# Altium schematic sheet C40 IMB POWER SUPPLY.SchDoc: C40 IMB POWER SUPPLY
size B; Organization: Carnegie Institution of Washington; DocumentNumber: 7; SheetNumber: 6; SheetTotal: 7; PageSetup: Record=PageOptions|CenterHorizontal=True|CenterVertical=True|PrintScale=1.12|XCorrection=1.00|YCorrection=1.00|PrintKind=0|BorderSize=5000000|LeftOffset=0|BottomOffset=0|Orientation=2|PaperLength=1000|PaperWidth=1000|Scale=100|PaperSource=15|PrintQuality=1200|MediaType=1|DitherType=10|PaperKind=11 x 17|PrintScaleMode=1
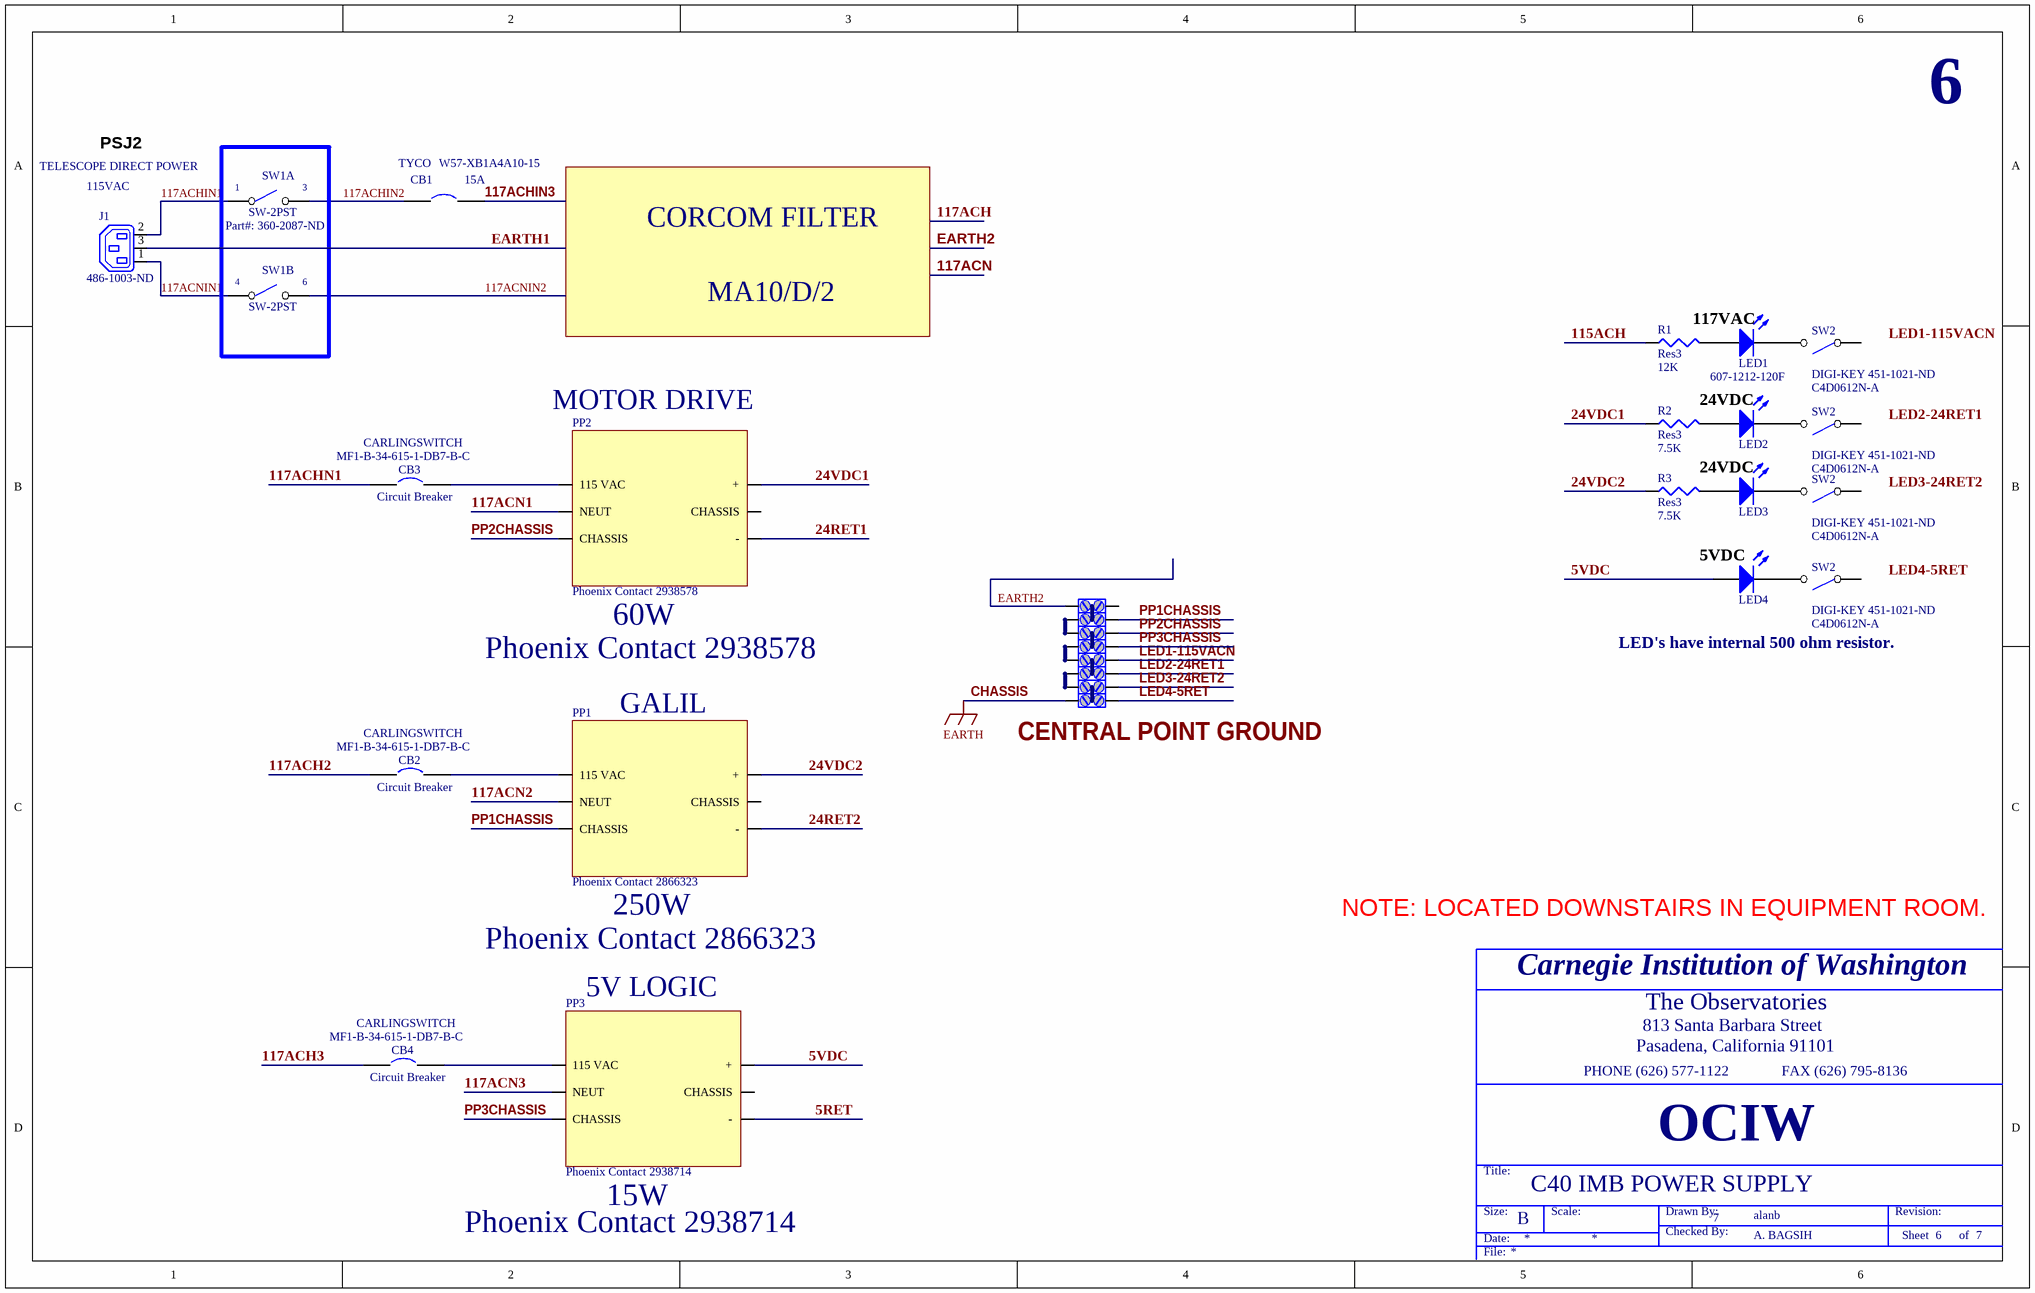
[diagram p0: C40 IMB POWER SUPPLY.SchDoc]

## Parts
(Parts that share a designator on the sheet are numbered #1, #2 ... from top to bottom, then left to right.)
?#1  (no value)
?#2  (no value)
?#3  (no value)
?#4  (no value)
?#5  (no value)
?#6  (no value)
?#7  (no value)
?#8  (no value)
CB1  15A
CB2  Circuit Breaker  Manufacturer: CARLINGSWITCH  PART#: MF1-B-34-615-1-DB7-B-C  [SPST-2]
CB3  Circuit Breaker  Manufacturer: CARLINGSWITCH  PART#: MF1-B-34-615-1-DB7-B-C  [SPST-2]
CB4  Circuit Breaker  Manufacturer: CARLINGSWITCH  PART#: MF1-B-34-615-1-DB7-B-C  [SPST-2]
D?#1  LED1  Manuf #: 607-1212-120F  [LED-0]
D?#2  LED2  [LED-0]
D?#3  LED3  [LED-0]
D?#4  LED4  [LED-0]
J1  115VAC  PART #: 486-1003-ND  [IEC7-2H3]
PP1  Phoenix Contact 2866323
PP2  Phoenix Contact 2938578
PP3  Phoenix Contact 2938714
R1  Res3  value 12K  [J1-0603]
R2  Res3  value 7.5K  [J1-0603]
R3  Res3  value 7.5K  [J1-0603]
SW1A  SW-2PST  Part#: 360-2087-ND
SW1B  SW-2PST
SW2#1  Part #: DIGI-KEY 451-1021-ND  Electroswitch: C4D0612N-A
SW2#2  Part #: DIGI-KEY 451-1021-ND  Electroswitch: C4D0612N-A
SW2#3  Part #: DIGI-KEY 451-1021-ND  Electroswitch: C4D0612N-A
SW2#4  Part #: DIGI-KEY 451-1021-ND  Electroswitch: C4D0612N-A

## Nets
CHASSIS: ?#8.1  [also labelled EARTH]
5RET: PP3.24(-)
5VDC: D?#4.1(A) PP3.25(+)
24RET1: PP2.24(-)
24RET2: PP1.24(-)
24VDC1: PP2.25(+) R2.1
24VDC2: PP1.25(+) R3.1
115ACH: R1.1
117ACH2: CB2.1
117ACH3: CB4.1
117ACHIN1: J1.2(N) SW1A.1
117ACHIN2: CB1.1 SW1A.2
117ACHIN3: CB1.2
117ACHN1: CB3.1
117ACN1: PP2.22(NEUT)
117ACN2: PP1.22(NEUT)
117ACN3: PP3.22(NEUT)
117ACNIN1: J1.1(L) SW1B.1
117ACNIN2: SW1B.2
EARTH1: J1.3(E)
EARTH2: ?#1.1
LED1-115VACN: ?#5.2
LED2-24RET1: ?#6.2
LED3-24RET2: ?#7.2
LED4-5RET: ?#8.2
PP1CHASSIS: ?#2.2 PP1.23(CHASSIS)
PP2CHASSIS: ?#3.2 PP2.23(CHASSIS)
PP3CHASSIS: ?#4.2 PP3.23(CHASSIS)
Net?#2_1: ?#2.1 ?#3.1
Net?#4_1: ?#4.1 ?#5.1
Net?#6_1: ?#6.1 ?#7.1
NetCB2_2: CB2.2 PP1.21(115_VAC)
NetCB3_2: CB3.2 PP2.21(115_VAC)
NetCB4_2: CB4.2 PP3.21(115_VAC)
NetD?#1_1: D?#1.1(A) R1.2
NetD?#1_2: D?#1.2(K) SW2#1.2
NetD?#2_1: D?#2.1(A) R2.2
NetD?#2_2: D?#2.2(K) SW2#2.2
NetD?#3_1: D?#3.1(A) R3.2
NetD?#3_2: D?#3.2(K) SW2#3.2
NetD?#4_2: D?#4.2(K) SW2#4.2

Not connected (* = marked no-connect by the designer): ?#1 2; PP1 ?1(CHASSIS); PP2 ?1(CHASSIS); PP3 ?1(CHASSIS); SW2#1 1; SW2#2 1; SW2#3 1; SW2#4 1

## Notes on the sheet
- PSJ2
- 6
- TELESCOPE DIRECT POWER
- (near SW1A) 1
- (near SW1A) 3
- CORCOM FILTER
- (near SW1B) 4
- (near SW1B) 6
- MA10/D/2
- 117VAC
- MOTOR DRIVE
- 24VDC
- (near D?#4) 5VDC
- 60W
- Phoenix Contact 2938578
- LED's have internal 500 ohm resistor.
- GALIL
- Phoenix Contact 2866323
- 250W
- NOTE: LOCATED DOWNSTAIRS IN EQUIPMENT ROOM.
- 5V LOGIC
- Phoenix Contact 2938714
- 15W
- Labels drawn without touching a wire or pin: CENTRAL POINT GROUND, LED1-115VACN, LED2-24RET1, LED3-24RET2, LED4-5RET
- Carnegie Institution of Washington
- 813 Santa Barbara Street
- The Observatories
- PHONE (626) 577-1122               FAX (626) 795-8136
- Pasadena, California 91101
- Title:
- OCIW
- Size:
- Date:
- B
- Scale:
- Drawn By:
- Checked By:
- A. BAGSIH
- alanb
- Revision:
- Sheet          of
- File:
- (in symbol CIRCUIT BREAKER) TYCO; W57-XB1A4A10-15

## Library data of the parts
?#1-?#8 = TB3
CB1 = CIRCUIT BREAKER: Newark Part Number:  98K3355  TYCO ELECTRONICS / POTTER & BRUMFIELD - W57-XB1A4A10-15 - CIRCUIT BREAKER, THERMAL, 1P, 250V, 15A
D?#1 = LED0: Typical INFRARED GaAs LED; Published: 8-Jun-2000; LatestRevisionDate: 08-Jul-2005; LatestRevisionNote: Mech Layer 1 removed.; PackageReference: LED-0; Publisher: Altium Limited
D?#2-D?#4 = LED0: Typical INFRARED GaAs LED; Manuf #: 607-1212-120F; Published: 8-Jun-2000; LatestRevisionDate: 08-Jul-2005; LatestRevisionNote: Mech Layer 1 removed.; PackageReference: LED-0; Publisher: Altium Limited
J1 = Plug AC Female: IEC Mains Power Outlet, EN60 320-2-2 F Class I, PC Flange Rear Mount, Chassis Socket; PackageDocument: ver.80, 15-Sep-2003; MaximumRating: 10A, 250V a.c. (UL & CSA 15A, 250V a.c.); MountingFixtures: Not drawn on schematic symbol.; PCB_Layout: Complies with manufacturer's recommendation.; DrillSize: Corresponds to nominal value.; Published: 15-Jul-2004; LatestRevisionDate: 15-Jul-2004; LatestRevisionNote: Component Replaced & renamed from "Phonejack".; DatasheetDocument: ver.80, 15-Sep-2003; PackageReference: PX0675/PC; Publisher: Altium Limited; Terminations: P.C. Spills; ComponentLink1Description: Manufacturer Link; ComponentLink1URL: http://www.bulgin.co.uk/
PP1-PP3 = Power Supply 1
R1-R3 = Res3: Resistor; Published: 8-Jun-2000; LatestRevisionDate: 04-Mar-2005; LatestRevisionNote: PCB Footprint replaced.; PackageReference: J1-0603; Publisher: Altium Limited
SW1A SW1B = SW-SPST: Digi-Key Part Number 360-2087-ND   SWITCH TOGGLE DPST 25A
SW2#1-SW2#4 = SW-SPST
CB2-CB4 = Circuit Breaker: Published: 24-Mar-1999; LatestRevisionDate: 17-Jul-2002; LatestRevisionNote: Re-released for DXP Platform.; PackageReference: SPST-2; Publisher: Altium Limited